# EAGLE design kriner-pc (EAGLE 6.5.0)
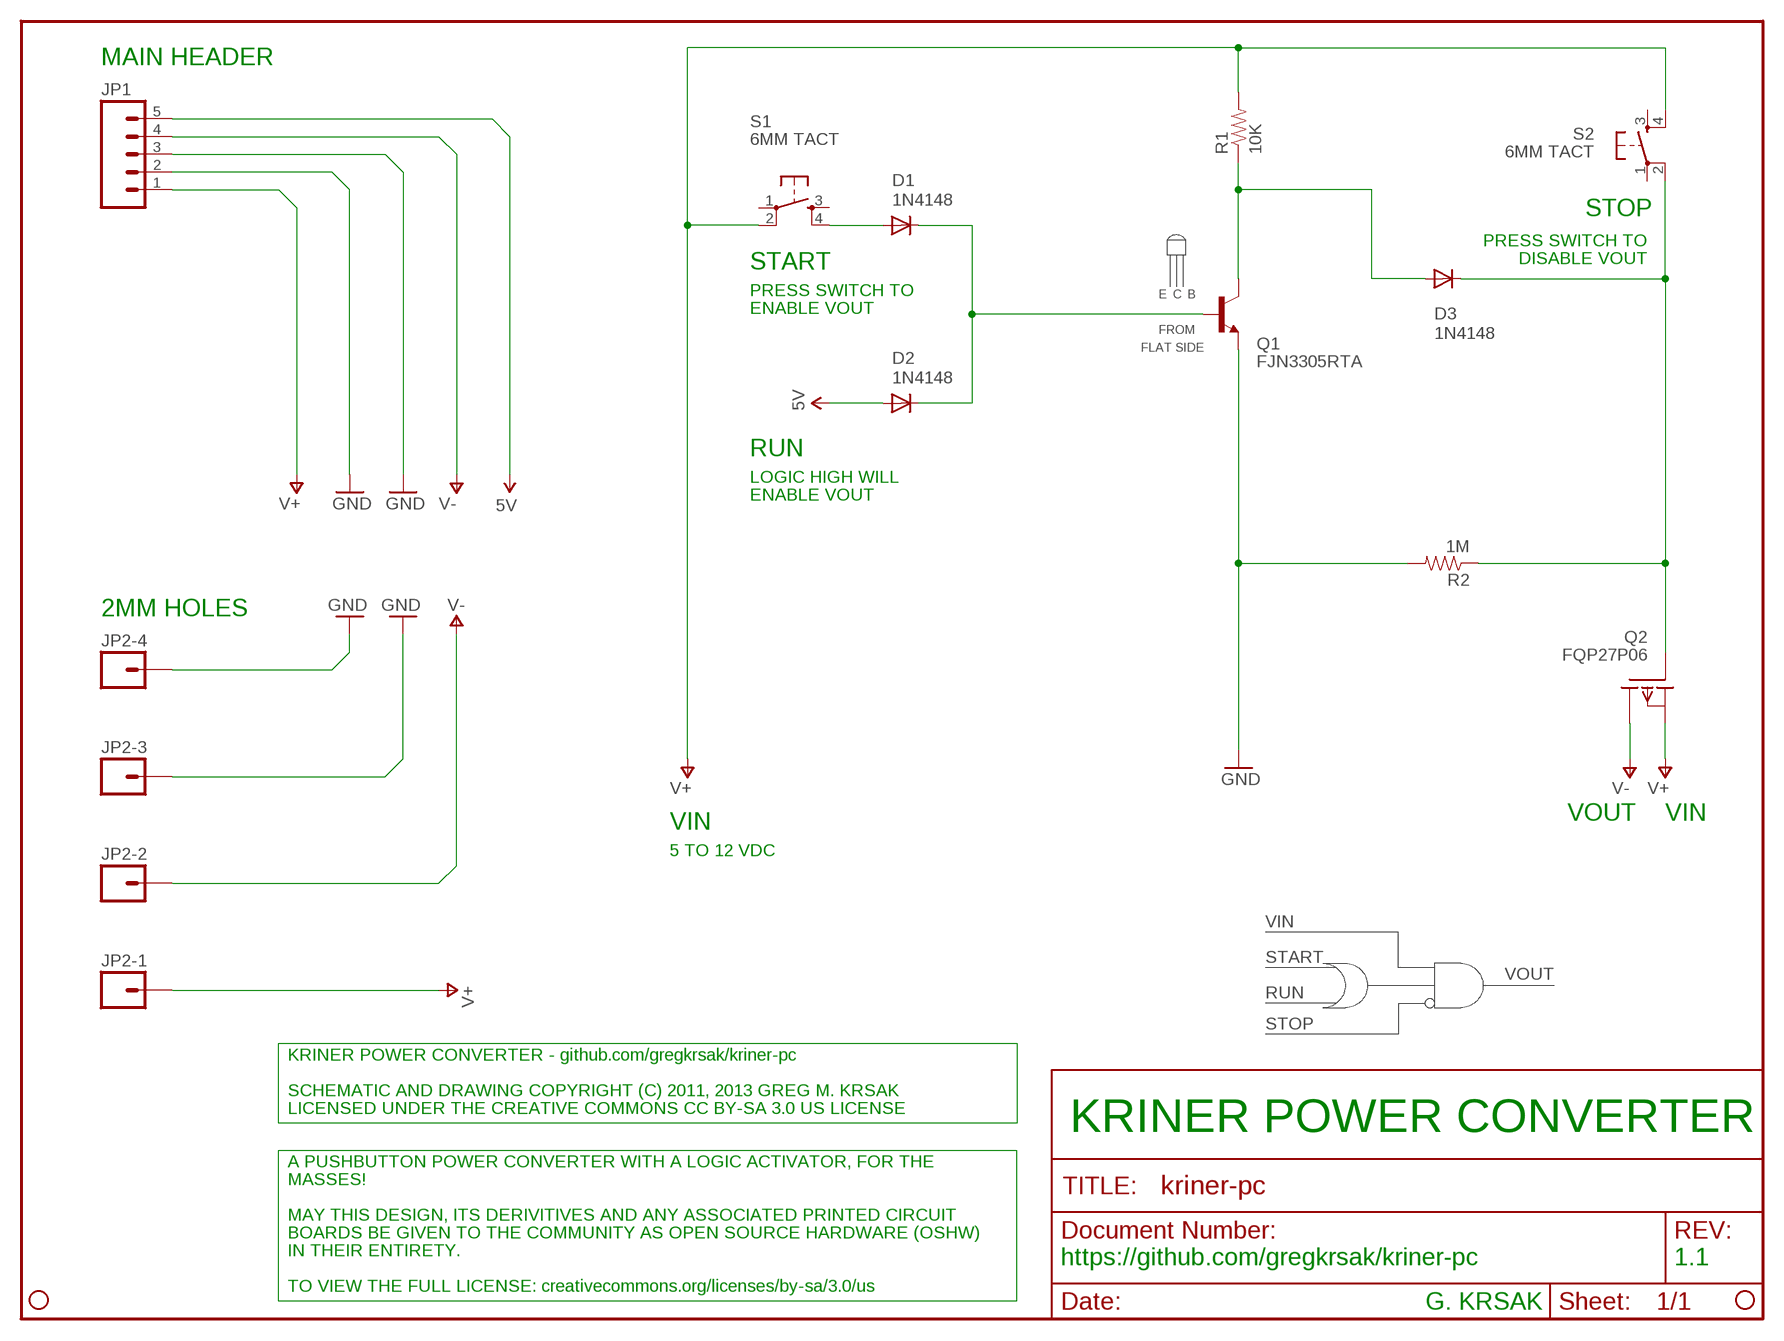
[diagram p0: schematic, sheet 1]

## Parts
D1  1N4148  DIODE1N4148  [DIODE-1N4148]
D2  1N4148  DIODE1N4148  [DIODE-1N4148]
D3  1N4148  DIODE1N4148  [DIODE-1N4148]
JP1  M05LOCK  [1X05_LOCK]
JP2  STAND-OFF  [STAND-OFF]
JP2-1  M01PTH_2MM  [1X01_2MM]
JP2-2  M01PTH_2MM  [1X01_2MM]
JP2-3  M01PTH_2MM  [1X01_2MM]
JP2-4  M01PTH_2MM  [1X01_2MM]
JP3  STAND-OFF  [STAND-OFF]
Q1  FJN3305RTA  -NPN-TO92-ECB  [TO92-ECB]
Q2  FQP27P06  SUP65P06-20  [TO220]
R1  10K  RESISTORAXIAL-0.3  [AXIAL-0.3]
R2  1M  RESISTORAXIAL-0.3  [AXIAL-0.3]
S1  6MM TACT  TAC_SWITCHPTH  [TACTILE-PTH]
S2  6MM TACT  TAC_SWITCHPTH  [TACTILE-PTH]

## Nets
5V: D2.A JP1.5
GND: JP1.2 JP1.3 JP2-3.1 JP2-4.1 Q1.E R2.P$2
N$1: D1.C D2.C Q1.B
N$2: D1.A S1.4
N$3: D3.C Q2.1(G) R2.P$1 S2.2
N$6: D3.A Q1.C R1.P$1
V+: JP1.1 JP2-1.1 Q2.3(S) R1.P$2 S1.2 S2.4
V-: JP1.4 JP2-2.1 Q2.2(D)
Unconnected: S1.1 S1.3 S2.1 S2.3

## Notes on the sheet
- MAIN HEADER
- STOP
- PRESS SWITCH TO
- DISABLE VOUT
- START
- PRESS SWITCH TO | E | C | B
- ENABLE VOUT
- FROM
- FLAT SIDE
- RUN
- LOGIC HIGH WILL
- ENABLE VOUT
- 2MM HOLES
- VOUT | VIN
- VIN
- 5 TO 12 VDC
- VIN
- START | VOUT
- RUN
- STOP
- KRINER POWER CONVERTER - github.com/gregkrsak/kriner-pc
- SCHEMATIC AND DRAWING COPYRIGHT (C) 2011, 2013 GREG M. KRSAK
- LICENSED UNDER THE CREATIVE COMMONS CC BY-SA 3.0 US LICENSE
- KRINER POWER CONVERTER
- A PUSHBUTTON POWER CONVERTER WITH A LOGIC ACTIVATOR, FOR THE
- MASSES!
- MAY THIS DESIGN, ITS DERIVITIVES AND ANY ASSOCIATED PRINTED CIRCUIT
- BOARDS BE GIVEN TO THE COMMUNITY AS OPEN SOURCE HARDWARE (OSHW)
- IN THEIR ENTIRETY.
- https://github.com/gregkrsak/kriner-pc | 1.1
- TO VIEW THE FULL LICENSE: creativecommons.org/licenses/by-sa/3.0/us
- G. KRSAK
- /Users/gregkrsak/Desktop/GPL-v3-BMP.bmp

## Library data of the parts
D1-D3 = SparkFun:DIODE: Diode These are standard reverse protection diodes and small signal diodes. SMA package can handle up to about 1A. SOD-323 can handle about 200mA. What the SOD-323 package when ordering, there are some mfgs out there that are 5-pin packages.
JP1 = SparkFun:M05: Header 5 Standard 5-pin 0.1" header. Use with straight break away headers (SKU : PRT-00116), right angle break away headers (PRT-00553), swiss pins (PRT-00743), machine pins (PRT-00117), and female headers (PRT-00115). Molex polarized connector foot print use with SKU : PRT-08230 with associated crimp pins and housings.
JP2 JP3 = SparkFun:STAND-OFF: Stand Off This is the mechanical footprint for a #4 phillips button head screw. Use the keepout ring to avoid running the screw head into surrounding components. SKU : PRT-00447
JP2-1-JP2-4 = SparkFun:M01: Header 1 Standard 1-pin 0.1" header. Use with straight break away headers (SKU : PRT-00116), right angle break away headers (PRT-00553), swiss pins (PRT-00743), machine pins (PRT-00117), and female headers (PRT-00115).
Q1 = transistor:*-NPN-: NPN Transistror BF959 corrected 2008.03.06
Q2 = transistor-fet:SUP65P06-20: P-Channel Enhancement MOSFET -60V; 60A; 0,020Ohm
R1 R2 = SparkFun:RESISTOR: Resistor Basic schematic elements and footprints for 0603, 1206, and PTH resistors.
S1 S2 = SparkFun:TAC_SWITCH: Momentary Switch Button commonly used for reset or general input. Spark Fun Electronics SKU : COM-00097

## Board
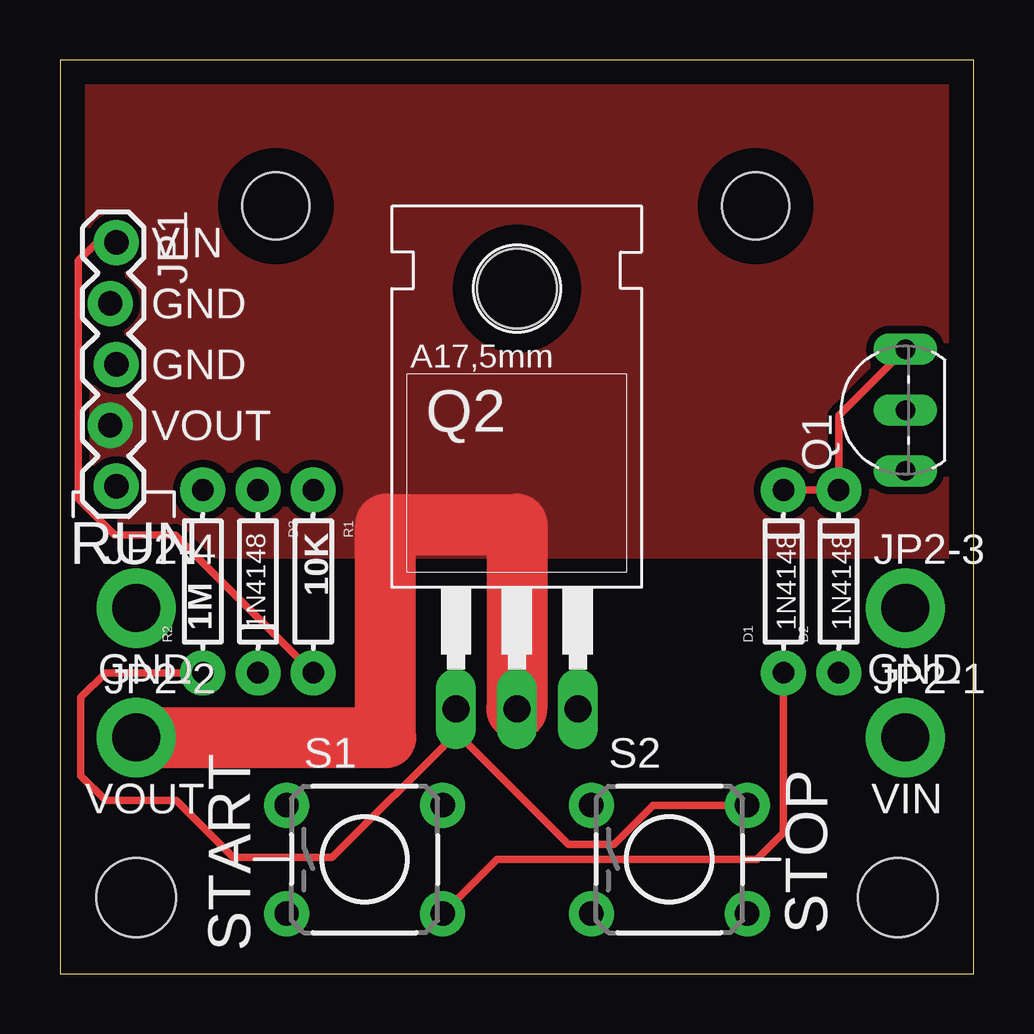
[diagram p1: board, top side]
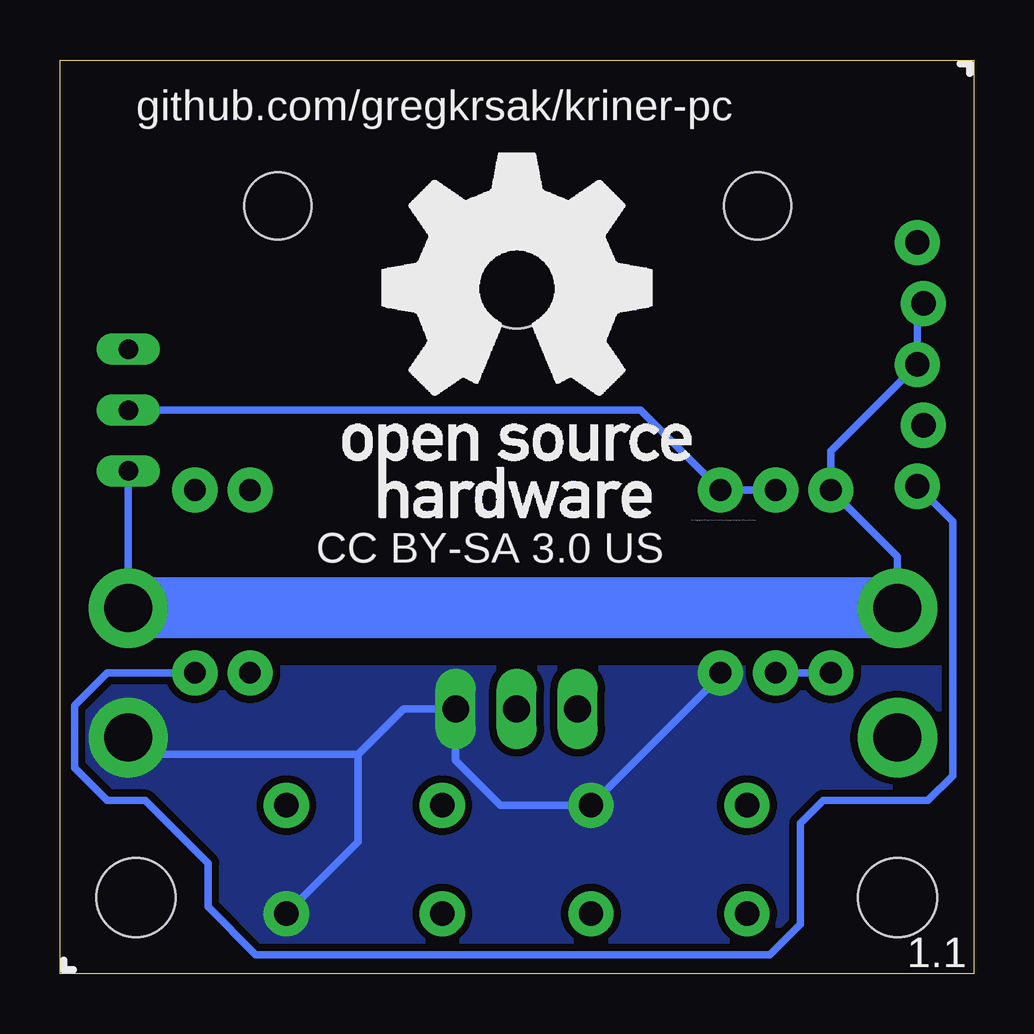
[diagram p2: board, bottom side, seen from below]

Size 38.09 x 38.09 mm. Coordinates in mm from the lower left corner, seen from the top.
Outline: 0,0 38.09,0 38.09,38.09 0,38.09 0,0
Copper layers (1*16): Top 0.035mm / dielectric 1.5mm / Bottom 0.035mm
Design rules "default": minimum track width 10mil, minimum drill 24mil, track to track 8mil, track to pad 8mil, pad to pad 8mil, via to via 8mil, smd to smd 8mil, copper to edge 40mil, drill to drill 8mil, minimum pad ring 10mil, minimum via ring 8mil, stop-mask expansion 4mil, vias tented up to drill 0mil, thermal gap 10mil
Holes 2.8 mm at 9,32 29,32

### Footprints (pad centres in the part's own frame; a part is rotated, then mirrored left to right if it is on the bottom)
DIODE-1N4148 = drill 0.9 pad 1.88: A -3.81,0; C 3.81,0
1X05_LOCK = drill 1.016 pad 1.88: 1 0,0.127; 2 2.54,-0.127; 3 5.08,0.127; 4 7.62,-0.127; 5 10.16,0.127
STAND-OFF = hole 3.302: 0,0
1X01_2MM = drill 2 pad 3.302: 1 0,0
TO92-ECB = drill 0.813 long: B 2.54,0; C 0,0; E -2.54,0
TO220 = drill 1.118 long: 1 -2.54,-6.35; 2 0,-6.35; 3 2.54,-6.35 | hole 3.302: 0,11.176
AXIAL-0.3 = drill 0.9 pad 1.88: P$1 -3.81,0; P$2 3.81,0
TACTILE-PTH = drill 1.016 pad 1.88: 1 -3.251,2.261; 2 3.251,2.261; 3 -3.251,-2.261; 4 3.251,-2.261

### Placement (x,y rotation side)
D1  30.16,16.35 90 top
D2  32.46,16.35 90 top
D3  8.26,16.35 270 top
JP1  2.22,30.48 270 top
JP2  34.92,3.17 0 top
JP2-1  35.24,9.84 0 top
JP2-2  3.17,9.84 0 top
JP2-3  35.24,15.24 0 top
JP2-4  3.17,15.24 0 top
JP3  3.17,3.17 0 top
Q1  35.24,23.5 90 top
Q2  19.05,17.38 0 top
R1  10.56,16.35 270 top
R2  5.95,16.35 90 top
S1  12.7,4.76 0 top
S2  25.4,4.76 0 top

### Tracks (layer width: path | path; a pad name or v marks a point on that pad's centre or on a via)
5V
  Bottom 0.305: JP1.5 0.87,18.84 0.87,8.26 1.91,7.22 6.27,7.22 7.22,6.27 7.22,2.06 8.49,0.79 29.92,0.79 31.91,2.78 31.91,4.6 34.53,7.22 36.12,7.22 37.47,8.57 37.47,11.19 36.12,12.54 D2.A
GND
  Bottom 0.305: JP1.2 2.35,27.94 JP1.3 5.95,21.8 R2.P$2 3.17,17.38 JP2-4.1 | JP2-3.1 Q1.E
  Bottom 2.54: JP2-4.1 JP2-3.1
N$1
  Top 0.305: Q1.B 32.47,23.26 D2.C D1.C
N$2
  Top 0.305: S1.4 18.21,4.76 29.05,4.76 30.16,5.87 D1.A
N$3
  Top 0.305: 16.51,10.08 16.51,10 11.35,4.84 7.22,4.84 4.84,7.22 1.91,7.22 0.87,8.26 0.87,11.51 1.91,12.54 R2.P$1 | 16.51,10.08 Q2.1 | R2.P$1 | S2.2 24.72,7.02 23.1,5.4 21.19,5.4 16.51,10.08
  Bottom 0.305: R2.P$1 D3.C
N$6
  Bottom 0.305: D3.A | D3.A R1.P$1 13.89,23.5 Q1.C
V+
  Top 0.305: JP1.1 1.52,30.48 0.76,29.72 0.76,19.81 2.29,18.29 4.81,18.29 R1.P$2
  Bottom 0.305: R1.P$2 10.56,12.42 S1.2 19.72,7.02 21.59,8.89 Q2.3 23.77,11.03 25.65,9.14 | 25.65,9.14 25.65,5.5 S2.4 | 25.65,9.14 34.54,9.14 JP2-1.1
  pour Bottom (isolate 0.305, no thermals): 0,0 38.1,0 38.1,12.7 0,12.7
V-
  Top 2.54: JP2-2.1 13.57,9.84 13.57,18.73 19.05,18.73 Q2.2
  pour Top (isolate 0.305, no thermals): 0,38.1 0,17.46 38.1,17.46 38.1,38.1

### Text on the board
tPlace: VIN | GND | GND | VOUT | RUN | GND | GND | VOUT | VIN | STOP | START
bPlace: github.com/gregkrsak/kriner-pc | /Users/gregkrsak/Copy/electronics/kriner-pc/images/oshw-logo-600-px-mirror.bmp | CC BY-SA 3.0 US | 1.1
Reference: BOARD AND DRAWING COPYRIGHT (C) 2011, 2013 GREG M. KRSAK | LICENSED UNDER THE CREATIVE COMMONS CC BY-SA 3.0 US LICENSE | TO VIEW THE FULL LICENSE: creativecommons.org/licenses/by-sa/3.0/us